# EAGLE design out (EAGLE 9.5.2)
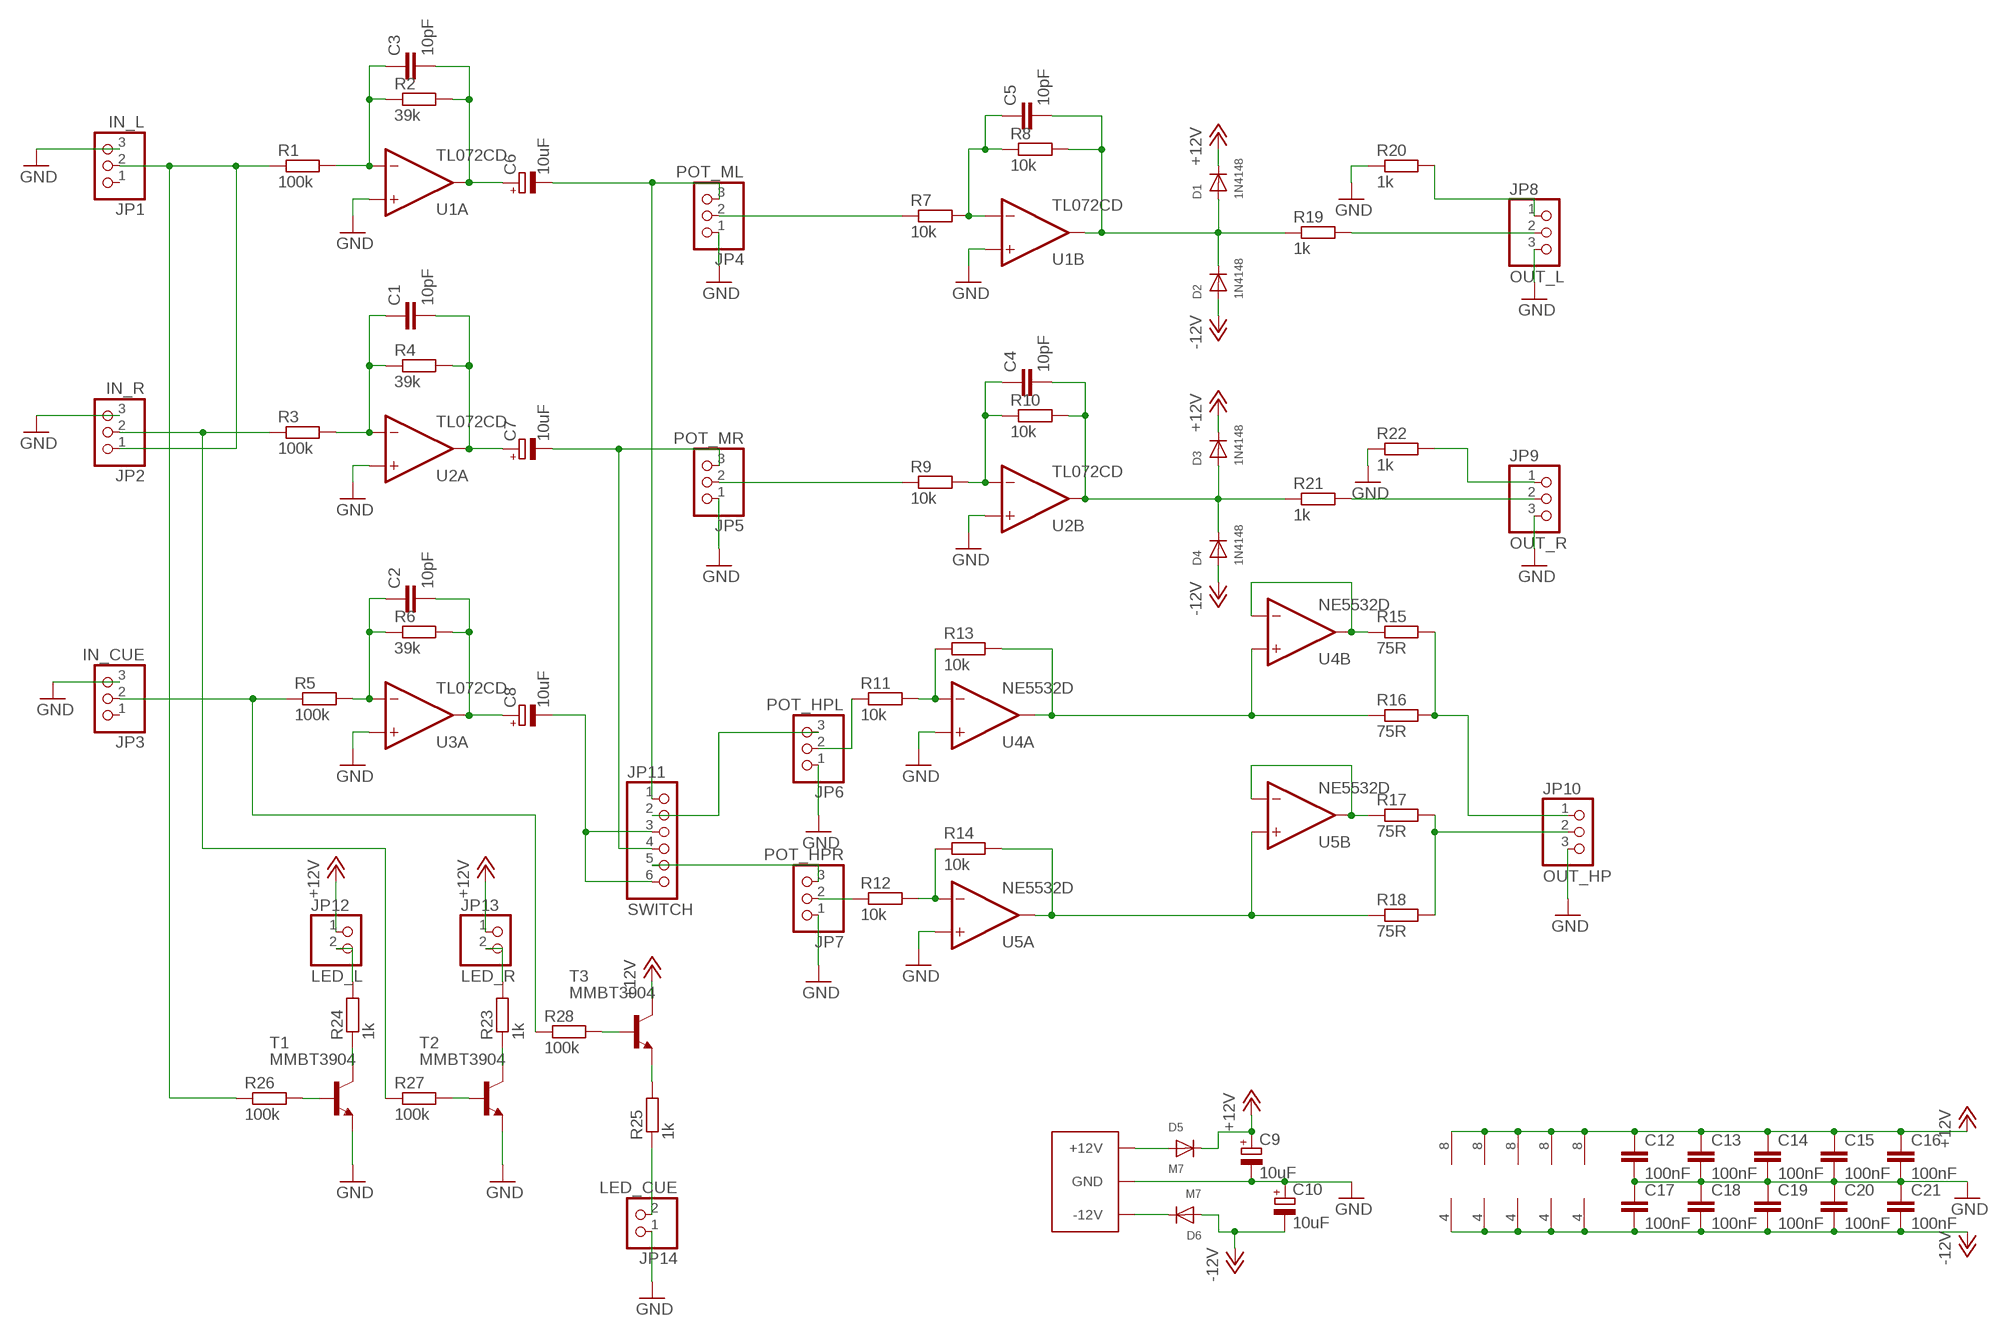
[diagram p0: schematic, sheet 1]

## Parts
C1  10pF  C-EUC0402  [C0402]
C2  10pF  C-EUC0402  [C0402]
C3  10pF  C-EUC0402  [C0402]
C4  10pF  C-EUC0402  [C0402]
C5  10pF  C-EUC0402  [C0402]
C6  10uF  CPOL-EUA/3216-18W  [A/3216-18W]
C7  10uF  CPOL-EUA/3216-18W  [A/3216-18W]
C8  10uF  CPOL-EUA/3216-18W  [A/3216-18W]
C9  10uF  CPOL-EUA/3216-18W  [A/3216-18W]
C10  10uF  CPOL-EUA/3216-18W  [A/3216-18W]
C11  EURO_POWER_LOCKFAT-LOCK  [EURO_PWR_HEADER_LOCK]
C12  100nF  C-EUC0402  [C0402]
C13  100nF  C-EUC0402  [C0402]
C14  100nF  C-EUC0402  [C0402]
C15  100nF  C-EUC0402  [C0402]
C16  100nF  C-EUC0402  [C0402]
C17  100nF  C-EUC0402  [C0402]
C18  100nF  C-EUC0402  [C0402]
C19  100nF  C-EUC0402  [C0402]
C20  100nF  C-EUC0402  [C0402]
C21  100nF  C-EUC0402  [C0402]
D1  1N4148  DIODESOD-323F  [SOD-323F]
D2  1N4148  DIODESOD-323F  [SOD-323F]
D3  1N4148  DIODESOD-323F  [SOD-323F]
D4  1N4148  DIODESOD-323F  [SOD-323F]
D5  M7  DIODESMA  [SMADIODE]
D6  M7  DIODESMA  [SMADIODE]
JP1  IN_L  PINHD-1X3  [1X03]
JP2  IN_R  PINHD-1X3  [1X03]
JP3  IN_CUE  PINHD-1X3  [1X03]
JP4  POT_ML  PINHD-1X3  [1X03]
JP5  POT_MR  PINHD-1X3  [1X03]
JP6  POT_HPL  PINHD-1X3  [1X03]
JP7  POT_HPR  PINHD-1X3  [1X03]
JP8  OUT_L  PINHD-1X3  [1X03]
JP9  OUT_R  PINHD-1X3  [1X03]
JP10  OUT_HP  PINHD-1X3  [1X03]
JP11  SWITCH  PINHD-1X6  [1X06]
JP12  LED_L  PINHD-1X2  [1X02]
JP13  LED_R  PINHD-1X2  [1X02]
JP14  LED_CUE  PINHD-1X2  [1X02]
R1  100k  R-EU_R0402  [R0402]
R2  39k  R-EU_R0402  [R0402]
R3  100k  R-EU_R0402  [R0402]
R4  39k  R-EU_R0402  [R0402]
R5  100k  R-EU_R0402  [R0402]
R6  39k  R-EU_R0402  [R0402]
R7  10k  R-EU_R0402  [R0402]
R8  10k  R-EU_R0402  [R0402]
R9  10k  R-EU_R0402  [R0402]
R10  10k  R-EU_R0402  [R0402]
R11  10k  R-EU_R0402  [R0402]
R12  10k  R-EU_R0402  [R0402]
R13  10k  R-EU_R0402  [R0402]
R14  10k  R-EU_R0402  [R0402]
R15  75R  R-EU_R0402  [R0402]
R16  75R  R-EU_R0402  [R0402]
R17  75R  R-EU_R0402  [R0402]
R18  75R  R-EU_R0402  [R0402]
R19  1k  R-EU_R0402  [R0402]
R20  1k  R-EU_R0402  [R0402]
R21  1k  R-EU_R0402  [R0402]
R22  1k  R-EU_R0402  [R0402]
R23  1k  R-EU_R0402  [R0402]
R24  1k  R-EU_R0402  [R0402]
R25  1k  R-EU_R0402  [R0402]
R26  100k  R-EU_R0402  [R0402]
R27  100k  R-EU_R0402  [R0402]
R28  100k  R-EU_R0402  [R0402]
T1  MMBT3904  MMBT3904LT1-NPN-SOT23-BEC  [SOT23-BEC]
T2  MMBT3904  MMBT3904LT1-NPN-SOT23-BEC  [SOT23-BEC]
T3  MMBT3904  MMBT3904LT1-NPN-SOT23-BEC  [SOT23-BEC]
U1  TL072CD  [SOIC8]
U2  TL072CD  [SOIC8]
U3  TL072CD  [SOIC8]
U4  NE5532D  [SOIC8]
U5  NE5532D  [SOIC8]

## Nets
+12V [power]: C9.+ C12.1 C13.1 C14.1 C15.1 C16.1 D1.C D3.C D5.C JP12.1 JP13.1 T3.C U1.8(P:V+) U2.8(P:V+) U3.8(P:V+) U4.8(P:V+) U5.8(P:V+)
-12V [power]: C10.- C17.2 C18.2 C19.2 C20.2 C21.2 D2.A D4.A D6.A U1.4(P:V-) U2.4(P:V-) U3.4(P:V-) U4.4(P:V-) U5.4(P:V-)
GND [power]: C9.- C10.+ C11.GND1(GND) C11.GND2(GND) C11.GND3(GND) C11.GND4(GND) C11.GND5(GND) C11.GND6(GND) C12.2 C13.2 C14.2 C15.2 C16.2 C17.1 C18.1 C19.1 C20.1 C21.1 JP1.3 JP2.3 JP3.3 JP4.1 JP5.1 JP6.1 JP7.1 JP8.3 JP9.3 JP10.3 JP14.1 R20.1 R22.1 T1.E T2.E U1.3(A:+IN) U1.5(B:+IN) U2.3(A:+IN) U2.5(B:+IN) U3.3(A:+IN) U4.3(A:+IN) U5.3(A:+IN)
N$1: C5.2 D1.A D2.C R8.2 R19.1 U1.7(B:OUT)
N$2: C4.2 D3.A D4.C R10.2 R21.1 U2.7(B:OUT)
N$3: C5.1 R7.2 R8.1 U1.6(B:-IN)
N$4: R15.1 U4.6(B:-IN) U4.7(B:OUT)
N$5: JP10.1 R15.2 R16.2
N$6: R14.2 R18.1 U5.1(A:OUT) U5.5(B:+IN)
N$7: R17.1 U5.6(B:-IN) U5.7(B:OUT)
N$8: C4.1 R9.2 R10.1 U2.6(B:-IN)
N$9: JP10.2 R17.2 R18.2
N$10: JP4.2 R7.1
N$11: R11.2 R13.1 U4.2(A:-IN)
N$12: R13.2 R16.1 U4.1(A:OUT) U4.5(B:+IN)
N$13: R12.2 R14.1 U5.2(A:-IN)
N$14: C2.1 R5.2 R6.1 U3.2(A:-IN)
N$15: C6.- JP4.3 JP11.1
N$16: C2.2 C8.+ R6.2 U3.1(A:OUT)
N$17: C7.- JP5.3 JP11.4
N$18: JP5.2 R9.1
N$19: C1.1 R3.2 R4.1 U2.2(A:-IN)
N$20: JP7.2 R12.1
N$21: C1.2 C7.+ R4.2 U2.1(A:OUT)
N$22: JP6.2 R11.1
N$23: JP8.2 R19.2
N$24: C3.1 R1.2 R2.1 U1.2(A:-IN)
N$25: JP9.2 R21.2
N$26: C3.2 C6.+ R2.2 U1.1(A:OUT)
N$27: JP9.1 R22.2
N$28: JP8.1 R20.2
N$29: JP1.2 JP2.1 R1.1 R26.1
N$30 [power]: C11.POS1(+12V) C11.POS2(+12V) D5.A
N$31: JP3.2 R5.1 R28.1
N$32: JP6.3 JP11.2
N$33: C8.- JP11.3 JP11.6
N$34: JP7.3 JP11.5
N$35: R24.1 T1.C
N$36: R26.2 T1.B
N$37: R23.1 T2.C
N$38: R28.2 T3.B
N$39: R25.2 T3.E
N$40: JP14.2 R25.1
N$41: JP13.2 R23.2
N$42: JP12.2 R24.2
N$43 [power]: C11.NEG1(-12V) C11.NEG2(-12V) D6.C
N$44: R27.2 T2.B
N$45: JP2.2 R3.1 R27.1
Unconnected: JP1.1 JP3.1 U3.5(B:+IN) U3.6(B:-IN) U3.7(B:OUT)

## Library data of the parts
C1-C5 C12-C21 = jhbruhn-cr:C-EU: CAPACITOR, European symbol; SPICEPREFIX: C
C6-C10 = rcl:CPOL-EU: POLARIZED CAPACITOR, European symbol; SPICEPREFIX: C
C11 = jhbruhn-physical:EURO_POWER_LOCK
D1-D6 = adafruit:DIODE: Diode SMADIODE - SMA Surface Mount Package 20V 1A Schottky Diode Digikey: 641-1014-6-ND DO-1N4148 - Through Hole Small Current Diode SOD-123 20V 1 A (.5mV Vf) Schottky Diode - Digikey: MBRX120TPMSCT-ND SOD-323 10V 570mA (.38mV Vf, 3ns) Schottky Diode - Digikey: ZLLS410CT-ND SOD-523 30V 30mA Schottky Diode (RB751S-40TE61) - Digikey: RB751S-40TE61CT-ND SOT23-R/W - SOT23 Package (R = Solder Paste/Reflow Ovens, W = Hand-Soldering) BAT54Film 40V 300mA - Digikey: 497-7162-1-ND
JP1-JP10 = pinhead:PINHD-1X3: PIN HEADER
JP11 = pinhead:PINHD-1X6: PIN HEADER
JP12-JP14 = pinhead:PINHD-1X2: PIN HEADER
R1-R28 = jhbruhn-cr:R-EU_: RESISTOR, European symbol; SPICEPREFIX: R
T1-T3 = transistor:*-NPN-: NPN Transistror BF959 corrected 2008.03.06
U1-U3 = jhbruhn-opamp:TL072: Generic Dual Op Amp
U4 U5 = jhbruhn-opamp:NE5532: Generic Dual Op Amp

## Net classes
0 default: width 0.254 mm
1 power: width 0.406 mm

## Board
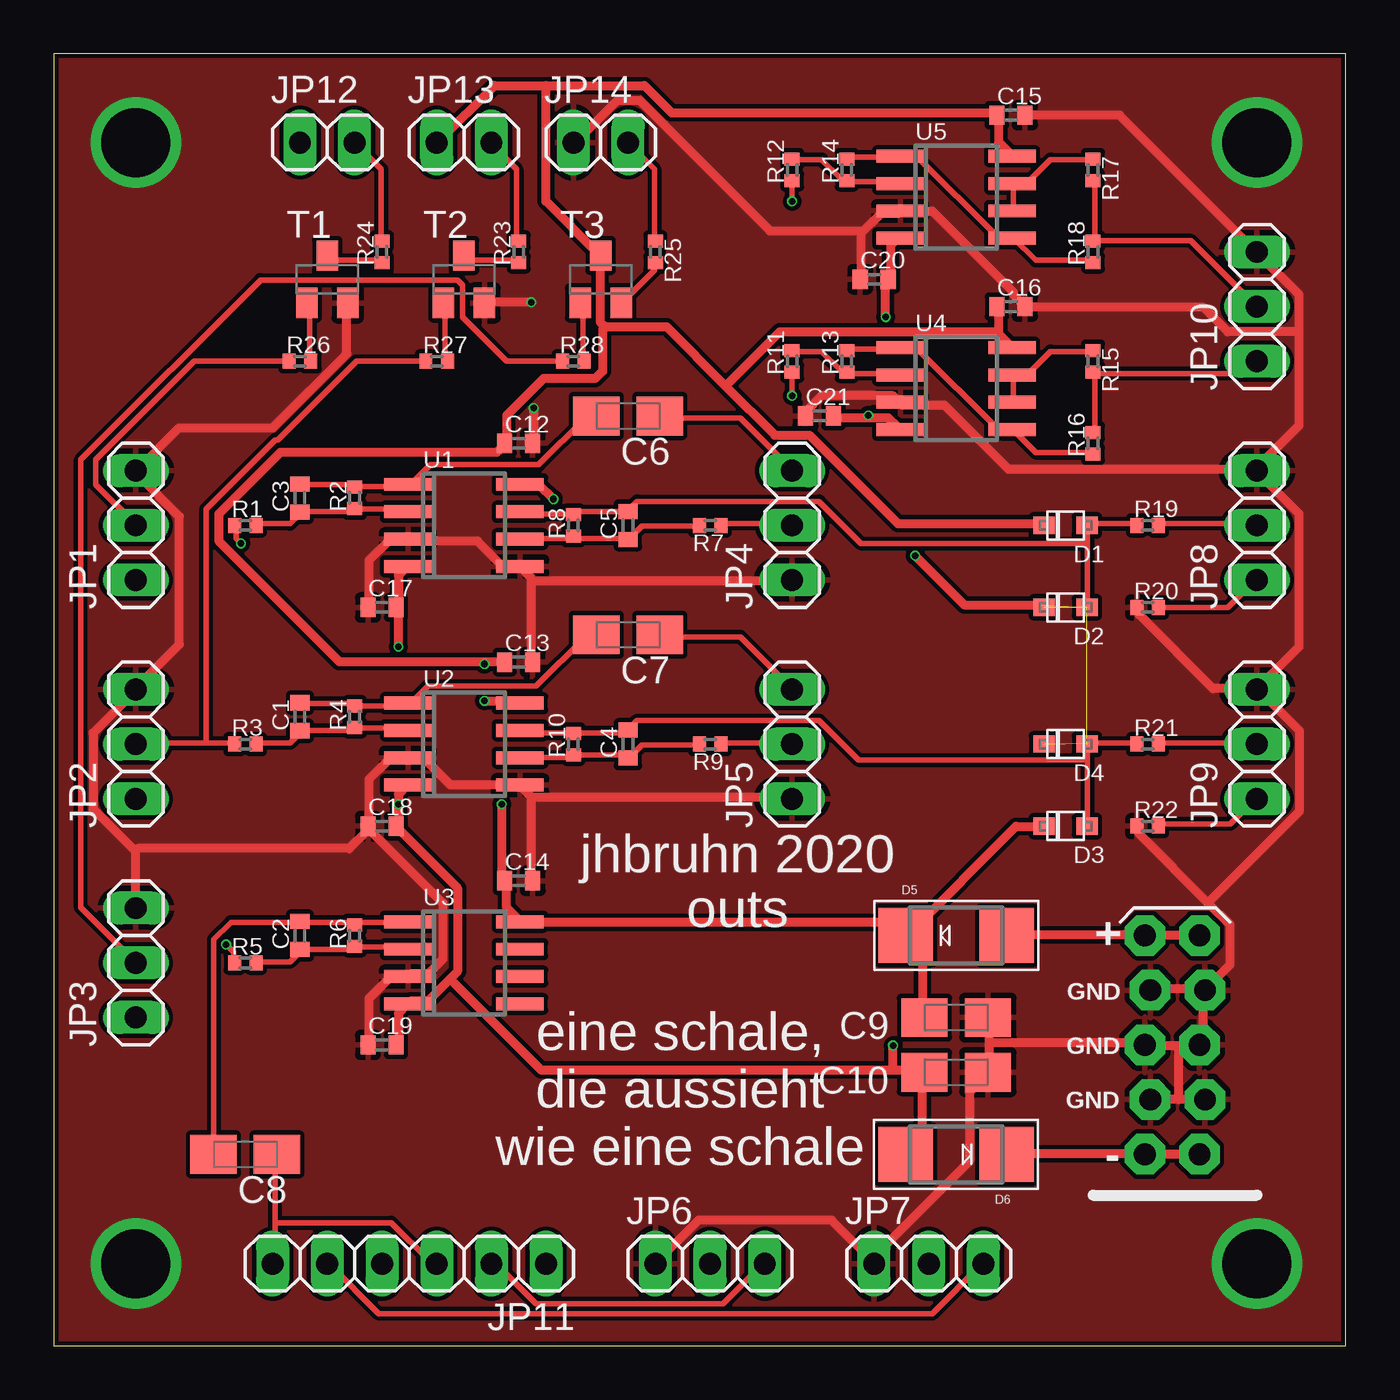
[diagram p1: board, top side]
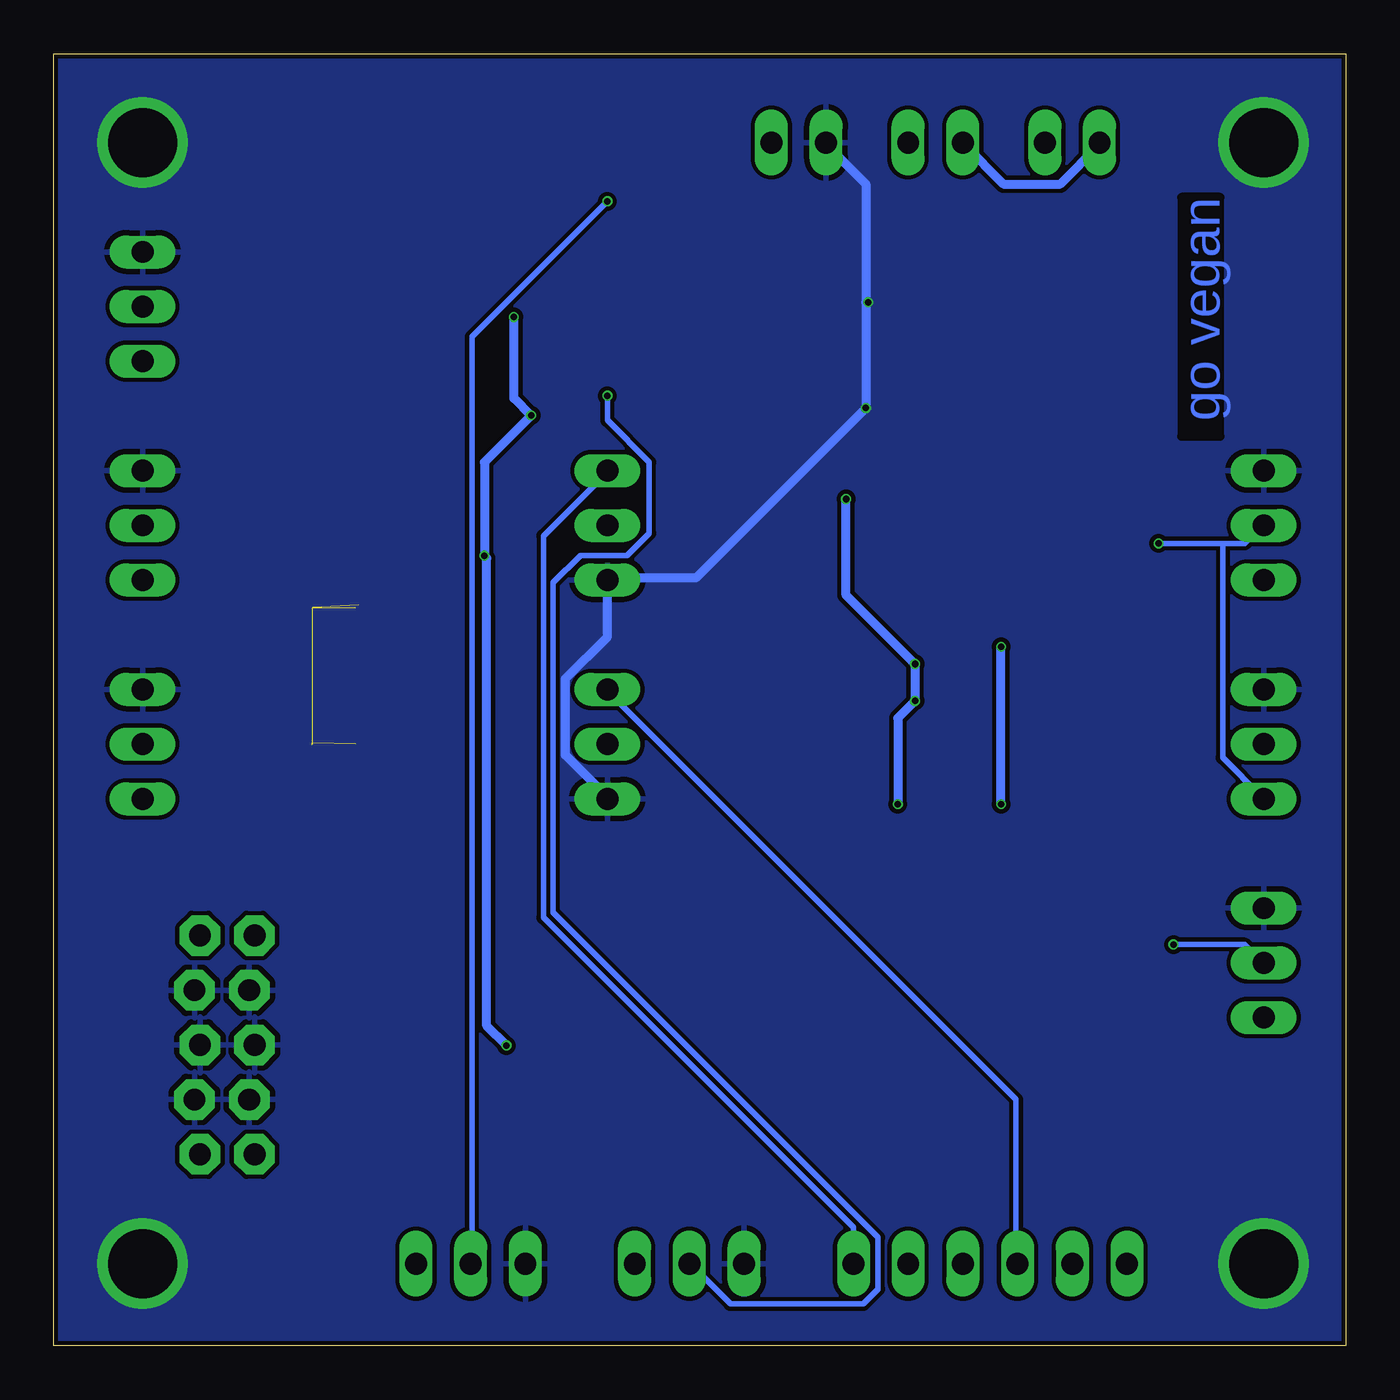
[diagram p2: board, bottom side, seen from below]

Size 60 x 60 mm. Coordinates in mm from the lower left corner, seen from the top.
Outline: 0,0 60,0 60,60 0,60 0,0
Copper layers (1*16): Top 0.035559375mm / dielectric 1.6mm / Bottom 0.035559375mm
Design rules "jlcpcb2layer": minimum track width 10mil, minimum drill 12mil, track to track 8mil, track to pad 8mil, pad to pad 5mil, via to via 10mil, smd to smd 5mil, copper to edge 8mil, drill to drill 6mil, minimum pad ring 5mil, minimum via ring 3mil, stop-mask expansion 2.5mil, vias tented up to drill 0mil, thermal gap 10mil

### Footprints (pad centres in the part's own frame; a part is rotated, then mirrored left to right if it is on the bottom)
C0402 = smd 0.7 x 0.9: 1 -0.65,0; 2 0.65,0
A/3216-18W = smd 2.15 x 1.8: + 1.475,0; - -1.475,0
EURO_PWR_HEADER_LOCK = drill 1.016 pad 1.88 octagon: GND1 -2.54,1.143; GND2 -2.54,-1.397; GND3 0,1.397; GND4 0,-1.143; GND5 2.54,1.143; GND6 2.54,-1.397; NEG1 -5.08,1.397; NEG2 -5.08,-1.143; POS1 5.08,1.397; POS2 5.08,-1.143
SOD-323F = smd 1 x 0.8: A -1,0; C 1,0
SMADIODE = smd 2.54 x 2.54: A 2.349,0; C -2.349,0
1X03 = drill 1.016 long: 1 -2.54,0; 2 0,0; 3 2.54,0
1X06 = drill 1.016 long: 1 -6.35,0; 2 -3.81,0; 3 -1.27,0; 4 1.27,0; 5 3.81,0; 6 6.35,0
1X02 = drill 1.016 long: 1 -1.27,0; 2 1.27,0
R0402 = smd 0.6 x 0.7: 1 -0.5,0; 2 0.5,0
SOT23-BEC = smd 1 x 1.4: B -0.95,-1.1; C 0,1.1; E 0.95,-1.1
SOIC8 = smd 0.6 x 2.2: 1 -1.905,-2.6; 2 -0.635,-2.6; 3 0.635,-2.6; 4 1.905,-2.6; 5 1.905,2.6; 6 0.635,2.6; 7 -0.635,2.6; 8 -1.905,2.6

### Placement (x,y rotation side)
C1  11.43,29.21 90 top
C2  11.43,19.05 90 top
C3  11.43,39.37 90 top
C4  26.67,27.94 90 top
C5  26.67,38.1 90 top
C6  26.67,43.18 180 top
C7  26.67,33.02 180 top
C8  8.89,8.89 180 top
C9  41.91,15.24 180 top
C10  41.91,12.7 0 top
C11  52.07,13.97 90 top
C12  21.59,41.91 0 top
C13  21.59,31.75 0 top
C14  21.59,21.59 0 top
C15  44.45,57.15 0 top
C16  44.45,48.26 0 top
C17  15.24,34.29 0 top
C18  15.24,24.13 0 top
C19  15.24,13.97 0 top
C20  38.1,49.53 0 top
C21  35.56,43.18 0 top
D1  46.99,38.1 180 top
D2  46.99,34.29 180 top
D3  46.99,24.13 180 top
D4  46.99,27.94 180 top
D5  41.91,19.05 0 top
D6  41.91,8.89 180 top
JP1  3.81,38.1 90 top
JP2  3.81,27.94 90 top
JP3  3.81,17.78 90 top
JP4  34.29,38.1 90 top
JP5  34.29,27.94 90 top
JP6  30.48,3.81 0 top
JP7  40.64,3.81 0 top
JP8  55.88,38.1 90 top
JP9  55.88,27.94 90 top
JP10  55.88,48.26 90 top
JP11  16.51,3.81 180 top
JP12  12.7,55.88 0 top
JP13  19.05,55.88 0 top
JP14  25.4,55.88 0 top
R1  8.89,38.1 0 top
R2  13.97,39.37 90 top
R3  8.89,27.94 0 top
R4  13.97,29.21 90 top
R5  8.89,17.78 0 top
R6  13.97,19.05 90 top
R7  30.48,38.1 180 top
R8  24.13,38.1 90 top
R9  30.48,27.94 180 top
R10  24.13,27.94 90 top
R11  34.29,45.72 90 top
R12  34.29,54.61 90 top
R13  36.83,45.72 90 top
R14  36.83,54.61 90 top
R15  48.26,45.72 270 top
R16  48.26,41.91 90 top
R17  48.26,54.61 270 top
R18  48.26,50.8 90 top
R19  50.8,38.1 0 top
R20  50.8,34.29 0 top
R21  50.8,27.94 0 top
R22  50.8,24.13 0 top
R23  21.59,50.8 90 top
R24  15.24,50.8 90 top
R25  27.94,50.8 270 top
R26  11.43,45.72 0 top
R27  17.78,45.72 0 top
R28  24.13,45.72 0 top
T1  12.7,49.53 0 top
T2  19.05,49.53 0 top
T3  25.4,49.53 0 top
U1  19.05,38.1 270 top
U2  19.05,27.94 270 top
U3  19.05,17.78 270 top
U4  41.91,44.45 270 top
U5  41.91,53.34 270 top

### Tracks (layer width: path | path; a pad name or v marks a point on that pad's centre or on a via)
+12V  (via drill 0.3)
  Top 0.406: U5.8 44.46,55.32 43.89,55.89 43.89,57.15 C15.1 43.66,57.26 28.69,57.26 27.43,58.52 22.86,58.52 | 22.86,58.52 20.46,58.52 17.83,55.89 JP13.1 | D3.C 45.95,24.12 44.69,24.12 39.66,19.09 D5.C | C9.+ 40.35,15.32 40.35,18.4 39.78,18.97 D5.C | D5.C 39.43,19.2 38.98,19.66 21.83,19.66 U3.8 21.6,19.77 21.03,20.34 21.03,21.49 C14.1 20.8,21.72 v20.8,25.15 | 20,31.77 13.26,31.77 7.66,37.38 7.66,38.63 10.52,41.49 20.57,41.49 20.92,41.83 C12.1 21.03,42.06 21.03,43.2 22.75,44.92 25.15,44.92 25.49,45.26 25.49,47.21 25.6,47.32 | 20,31.77 20.92,31.77 C13.1 | v20,29.95 21.6,29.95 U2.8 | v20,31.66 20,31.77 | U1.8 22.52,40.01 v23.2,39.32 | 43.89,47.09 43.89,46.98 44.46,46.41 U4.8 | 43.89,47.09 43.89,48.23 C16.1 | 31.2,44.58 28.46,47.32 25.6,47.32 | 31.2,44.58 33.49,42.29 35.09,42.29 39.2,38.18 45.95,38.18 D1.C | 25.6,47.32 25.38,47.55 25.38,50.52 T3.C 25.26,50.75 22.86,53.15 22.86,58.52 | 43.89,47.09 33.72,47.09 31.2,44.58
  Bottom 0.406: JP12.1 11.43,55.78 13.26,53.95 15.89,53.95 17.72,55.78 JP13.1 | v23.2,39.32 23.2,34.86 v20,31.66 v20,29.95 20.8,29.15 v20.8,25.15
-12V  (via drill 0.3)  (2 unrouted)
  Top 0.406: U5.4 39.2,51.44 38.86,51.09 38.86,49.61 C20.2 38.63,49.38 v38.63,47.78 | 37.83,43.09 38.75,43.09 39.2,42.63 U4.4 | 37.83,43.09 36.23,43.09 C21.2 | v37.83,43.2 37.83,43.09 | 45.83,34.4 42.29,34.4 v40.01,36.69 | D6.A 39.66,8.91 40.35,9.6 40.35,12.69 C10.- 40.23,12.8 38.98,12.8 | U1.4 16.34,36.12 16,35.78 16,34.29 C17.2 16,34.18 v16,32.46 | C19.2 16,14.06 16,15.43 16.34,15.77 U3.4 16.57,16 17.37,16 18.4,17.03 | U2.4 16.34,25.95 16,25.6 v16,25.15 16,24.23 C18.2 16,24 18.75,21.26 18.75,17.37 18.4,17.03 | 38.98,12.8 22.63,12.8 18.4,17.03 | 38.98,12.8 v38.98,13.95
  Bottom 0.406: v38.63,47.78 38.63,44.01 v37.83,43.2 40.01,41.03 v40.01,36.69 39.89,36.58 39.89,14.86 v38.98,13.95 | v16,25.15 v16,32.46
GND  (via drill 0.3, 3.2)
  Top 0.406: C17.1 14.63,34.29 14.63,36.46 15.54,37.38 16.34,37.38 U1.3 16.57,37.38 19.66,37.38 20.8,36.23 21.49,36.23 U1.5 21.72,36.12 22.17,35.66 22.17,35.55 | 22.17,35.55 22.17,31.77 C13.2 | 22.17,35.55 34.29,35.55 JP4.1 | T1.E 13.6,48.35 13.6,46.06 10.17,42.63 5.83,42.63 3.89,40.69 JP1.3 3.89,40.46 5.83,38.52 5.83,32.58 3.89,30.63 JP2.3 3.77,30.4 1.83,28.46 1.83,24.92 3.77,22.97 | 22.17,25.49 22.17,21.6 C14.2 | 22.17,25.49 21.72,25.95 U2.5 21.49,26.06 18.4,26.06 17.26,27.2 16.57,27.2 U2.3 16.34,27.2 15.54,27.2 14.63,26.29 14.63,24.23 C18.1 | 22.17,25.49 34.29,25.49 JP5.1 | 3.77,22.97 3.77,20.34 JP3.3 | C19.1 14.63,14.06 14.63,16.12 15.66,17.14 U3.3 16.57,17.26 17.37,17.26 18.06,17.95 18.06,20.57 14.63,24 C18.1 | 3.77,22.97 3.89,23.09 13.72,23.09 14.52,23.89 C18.1 | JP6.1 28,3.89 29.95,5.83 36.12,5.83 38.06,3.89 JP7.1 38.06,4.12 42.52,8.57 42.52,11.77 43.32,12.57 C10.+ 43.43,12.8 43.43,14.06 | 53.61,20.57 54.63,19.55 54.63,17.72 53.49,16.57 C11.GND6 | 53.61,20.57 50.41,23.77 50.41,24.12 R22.1 | C11.GND5 50.98,16.57 53.38,16.57 C11.GND6 | C11.GND2 52.23,11.43 | 52.23,11.43 C11.GND1 | 43.43,14.06 43.43,15.2 C9.- | 43.43,14.06 50.63,14.06 C11.GND3 50.86,13.95 52.23,13.95 | 52.23,13.95 53.15,13.95 C11.GND4 53.38,14.06 53.38,16.34 C11.GND6 | 52.23,13.95 52.23,11.43 | 37.49,51.66 37.49,49.61 C20.1 | 37.49,51.66 38.41,52.58 39.2,52.58 U5.3 39.32,52.69 40.8,52.69 44.58,48.92 44.58,48.81 45.03,48.35 C16.2 45.26,48.23 53.38,48.23 54.52,47.09 57.84,47.09 | v22.29,43.55 22.29,41.95 C12.2 | v22.17,48.46 20,48.46 T2.E | 37.49,51.66 37.38,51.78 33.26,51.78 27.2,57.84 26.18,57.84 24.23,55.89 JP14.1
  Top 0.406: C15.2 49.49,57.15 55.78,50.86 JP10.3 56.01,50.63 57.84,48.81 57.84,47.09 | C21.1 34.98,43.2 34.98,43.43 35.66,44.12 38.98,44.12 39.2,43.89 U4.3 39.43,43.66 41.38,43.66 44.35,40.69 55.78,40.69 JP8.3 | R20.1 50.41,34.29 50.41,33.95 53.84,30.52 55.78,30.52 JP9.3 | JP8.3 55.89,40.58 57.84,38.63 57.84,32.46 56.01,30.63 JP9.3 | 57.84,47.09 57.84,42.75 55.89,40.8 JP8.3 | 53.61,20.57 57.84,24.8 57.84,28.57 56.01,30.4 JP9.3
  Bottom 0.406: JP5.1 34.29,25.49 36.23,27.43 36.23,30.98 34.29,32.92 JP4.1 34.18,35.66 30.18,35.66 v22.29,43.55 22.29,48.46 | 22.29,48.46 22.29,53.95 24.12,55.78 JP14.1 | v22.17,48.46 22.29,48.46
  other vias: 3.81,55.88 55.88,55.88 55.88,3.81 3.81,3.81
  pour Top: -1.27,60.96 -1.27,-1.27 62.23,-1.27 62.23,60.96
  pour Bottom: -1.27,60.96 -1.27,-1.27 62.23,-1.27 62.23,60.96
N$1  (1 unrouted)
  Top 0.254: R19.1 50.29,38.18 48.01,38.18 D1.A 48.01,38.06 48.01,37.26 | 48.01,37.26 48.01,34.29 | U1.7 21.72,38.63 24.12,38.63 R8.2 24.12,38.75 26.63,38.75 C5.2 26.75,38.86 27.09,39.2 35.55,39.2 37.49,37.26 48.01,37.26
N$2  (2 unrouted)
  Top 0.254: 48.01,28 50.29,28 R21.1 | 48.01,27.89 48.01,27.2 | 48.01,27.2 48.01,24.23 D3.A | U2.7 21.72,28.57 21.83,28.46 24,28.46 R10.2 24.23,28.46 26.52,28.46 26.63,28.57 C4.2 26.75,28.69 27.09,29.03 35.55,29.03 37.38,27.2 48.01,27.2
N$3
  Top 0.254: R7.2 29.95,38.06 27.32,38.06 26.75,37.49 C5.1 26.63,37.49 24.23,37.49 R8.1 24.12,37.49 21.72,37.49 U1.6
N$4
  Top 0.254: R15.1 48.23,46.18 46.29,46.18 45.26,45.15 44.58,45.15 U4.7 44.58,45.03 44.58,43.89 U4.6
N$5
  Top 0.254: R16.2 48.35,42.52 48.35,45.15 R15.2 48.46,45.15 55.21,45.15 55.78,45.72 JP10.1
N$6
  Top 0.254: R14.2 36.92,55.21 39.2,55.21 U5.1 39.32,55.21 40.12,55.21 43.78,51.55 44.46,51.55 U5.5 44.58,51.44 45.61,50.41 48.23,50.41 R18.1
N$7
  Top 0.254: R17.1 48.23,55.09 46.29,55.09 45.26,54.06 44.58,54.06 U5.7 44.58,53.95 44.58,52.81 U5.6
N$8
  Top 0.254: R9.2 29.95,27.89 27.32,27.89 26.75,27.32 C4.1 26.63,27.32 26.52,27.43 24.23,27.43 R10.1 24.12,27.32 21.72,27.32 U2.6
N$9
  Top 0.254: R17.2 48.35,54.06 48.35,51.32 R18.2 48.46,51.32 52.81,51.32 55.78,48.35 JP10.2
N$10
  Top 0.254: R7.1 31.09,38.18 34.29,38.18 JP4.2
N$11
  Top 0.254: U4.2 39.2,45.15 36.92,45.15 R13.1 36.8,45.26 36.58,45.26 35.66,46.18 34.29,46.18 R11.2
N$12
  Top 0.254: R13.2 36.92,46.29 39.2,46.29 U4.1 39.32,46.29 40.12,46.29 43.78,42.63 44.46,42.63 U4.5 44.58,42.52 45.61,41.49 48.23,41.49 R16.1
N$13
  Top 0.254: U5.2 39.2,54.06 36.92,54.06 R14.1 36.8,54.18 36.58,54.18 35.66,55.09 34.29,55.09 R12.2
N$14
  Top 0.254: R5.2 9.49,17.83 10.97,17.83 11.43,18.29 C2.1 11.54,18.4 14.06,18.4 R6.1 14.06,18.52 16.34,18.52 U3.2
N$15
  Top 0.254: C6.- 28.23,43.09 31.89,43.09 34.29,40.69 JP4.3
  Bottom 0.254: JP11.1 22.86,5.49 37.26,19.89 37.26,37.6 34.29,40.58 JP4.3
N$16
  Top 0.254: U3.1 16.34,19.66 14.06,19.66 R6.2 13.95,19.66 11.43,19.66 C2.2 11.32,19.66 8.23,19.66 7.43,18.86 7.43,8.91 C8.+
N$17
  Top 0.254: C7.- 28.23,32.92 31.89,32.92 34.29,30.52 JP5.3
  Bottom 0.254: JP11.4 15.32,3.89 15.32,11.43 34.29,30.4 JP5.3
N$18
  Top 0.254: R9.1 31.09,28 34.29,28 JP5.2
N$19
  Top 0.254: R3.2 9.49,28 10.97,28 11.43,28.46 C1.1 11.54,28.57 14.06,28.57 R4.1 14.06,28.69 16.23,28.69 16.34,28.57 U2.2
N$20  (via drill 0.3)
  Top 0.254: v34.29,53.15 R12.1
  Bottom 0.254: v34.29,53.15 40.58,46.86 40.58,3.89 JP7.2
N$21
  Top 0.254: C1.2 11.43,29.83 13.95,29.83 R4.2 14.06,29.72 16.23,29.72 16.34,29.83 U2.1 16.57,29.83 17.37,30.63 22.4,30.63 24.69,32.92 25.15,32.92 C7.+
N$22  (via drill 0.3)
  Top 0.254: v34.29,44.12 R11.1
  Bottom 0.254: v34.29,44.12 34.29,42.98 32.35,41.03 32.35,37.72 33.38,36.69 35.55,36.69 36.8,35.43 36.8,20.12 21.72,5.03 21.72,2.63 22.4,1.94 28.57,1.94 30.4,3.77 JP6.2
N$23
  Top 0.254: R19.2 51.32,38.18 55.78,38.18 JP8.2
N$24
  Top 0.254: R1.2 9.49,38.18 10.97,38.18 11.43,38.63 C3.1 11.54,38.75 13.95,38.75 R2.1 14.06,38.86 16.23,38.86 16.34,38.75 U1.2
N$25
  Top 0.254: R21.2 51.32,28 55.78,28 JP9.2
N$26
  Top 0.254: C3.2 11.43,40.01 14.06,40.01 R2.2 14.06,39.89 16.23,39.89 16.34,40.01 U1.1 16.57,40.01 17.49,40.92 22.52,40.92 24.69,43.09 25.15,43.09 C6.+
N$27
  Top 0.254: R22.2 51.32,24.23 54.63,24.23 55.78,25.38 JP9.1
N$28
  Top 0.254: R20.2 54.52,34.29 55.78,35.55 JP8.1
N$29  (via drill 0.3)
  Top 0.254: v8.69,37.26 8.46,37.49 8.46,38.06 R1.1 | R26.1 6.51,45.72 1.94,41.15 1.94,40.01 3.77,38.18 JP1.2
  Bottom 0.254: 5.71,37.26 4.69,37.26 3.89,38.06 JP1.2 | 5.71,37.26 v8.69,37.26 | 5.71,37.26 5.71,27.32 3.89,25.49 JP2.1
N$30
  Top 0.406: D5.A 44.35,19.09 50.63,19.09 C11.POS1 50.86,19.09 53.15,19.09 C11.POS2
N$31  (via drill 0.3)
  Top 0.254: v8,18.63 8.34,18.29 8.34,17.83 R5.1 | R28.1 21.03,45.72 18.97,47.78 18.97,49.26 18.75,49.49 9.6,49.49 1.26,41.15 1.26,20.34 3.77,17.83 JP3.2
  Bottom 0.254: v8,18.63 4.69,18.63 3.89,17.83 JP3.2
N$32
  Top 0.254: JP11.2 20.34,3.77 20.57,3.77 22.4,1.94 31.09,1.94 32.92,3.77 JP6.3
N$33
  Top 0.254: 10.29,5.71 10.29,4 10.17,3.89 JP11.6 | 10.29,5.71 10.29,8.8 C8.- | 10.29,5.71 15.66,5.71 17.49,3.89 17.72,3.89 JP11.3
N$34
  Top 0.254: JP11.5 12.8,3.77 15.09,1.49 40.8,1.49 43.09,3.77 JP7.3
N$35
  Top 0.254: R24.1 15.2,50.41 12.92,50.41 12.8,50.52 T1.C
N$36
  Top 0.254: R26.2 11.89,45.72 11.89,48.23 11.77,48.35 T1.B
N$37
  Top 0.254: R23.1 21.49,50.41 19.2,50.41 19.09,50.52 T2.C
N$38
  Top 0.254: R28.2 24.57,45.72 24.57,48.23 24.46,48.35 T3.B
N$39
  Top 0.254: R25.2 27.89,50.29 27.89,49.95 26.4,48.46 T3.E
N$40
  Top 0.254: R25.1 27.89,51.32 27.89,54.63 26.75,55.78 JP14.2
N$41
  Top 0.254: R23.2 21.49,51.32 21.49,54.63 20.34,55.78 JP13.2
N$42
  Top 0.254: R24.2 15.2,51.32 15.2,54.63 14.06,55.78 JP12.2
N$43
  Top 0.406: D6.C 44.35,8.91 50.63,8.91 C11.NEG1 50.86,8.91 53.15,8.91 C11.NEG2
N$44
  Top 0.254: R27.2 18.17,45.72 18.17,48.35 T2.B
N$45
  Top 0.254: 7.09,28 3.89,28 JP2.2 | 7.09,28 8.34,28 R3.1 | R27.1 14.06,45.72 10.4,42.06 10.29,42.06 7.09,38.86 7.09,28

### Text on the board
Bottom: go vegan
tNames: jhbruhn 2020 | outs | eine schale, / die aussieht / wie eine schale